# Altium project nanoga_mezzanine.PrjPCB (part 2 of 2)

## Sheet B2B_connectors .SchDoc: =ProjectName
size 420 x 297 mm; Author: SBH; CompanyName: WUT; DrawnBy: SBH; Organization: ISE-WUT; Address1: Warsaw Univeristy of Technology; Address2: Nowowiejska 15/19; Revision: -; SheetNumber: -; SheetTotal: -; EDA_Number: ARTIQ; Projet: ADC/DAC MEZZANINE; ModifiedBy: -; CreateDate: XX/XX/XXXX; CheckedDate: -; Title2: B2B_connectors .SchDoc; DivGrp: ISE; Designer: SBH; ModifiedDate: -; ProjectName: ADC/DAC MEZZANINE
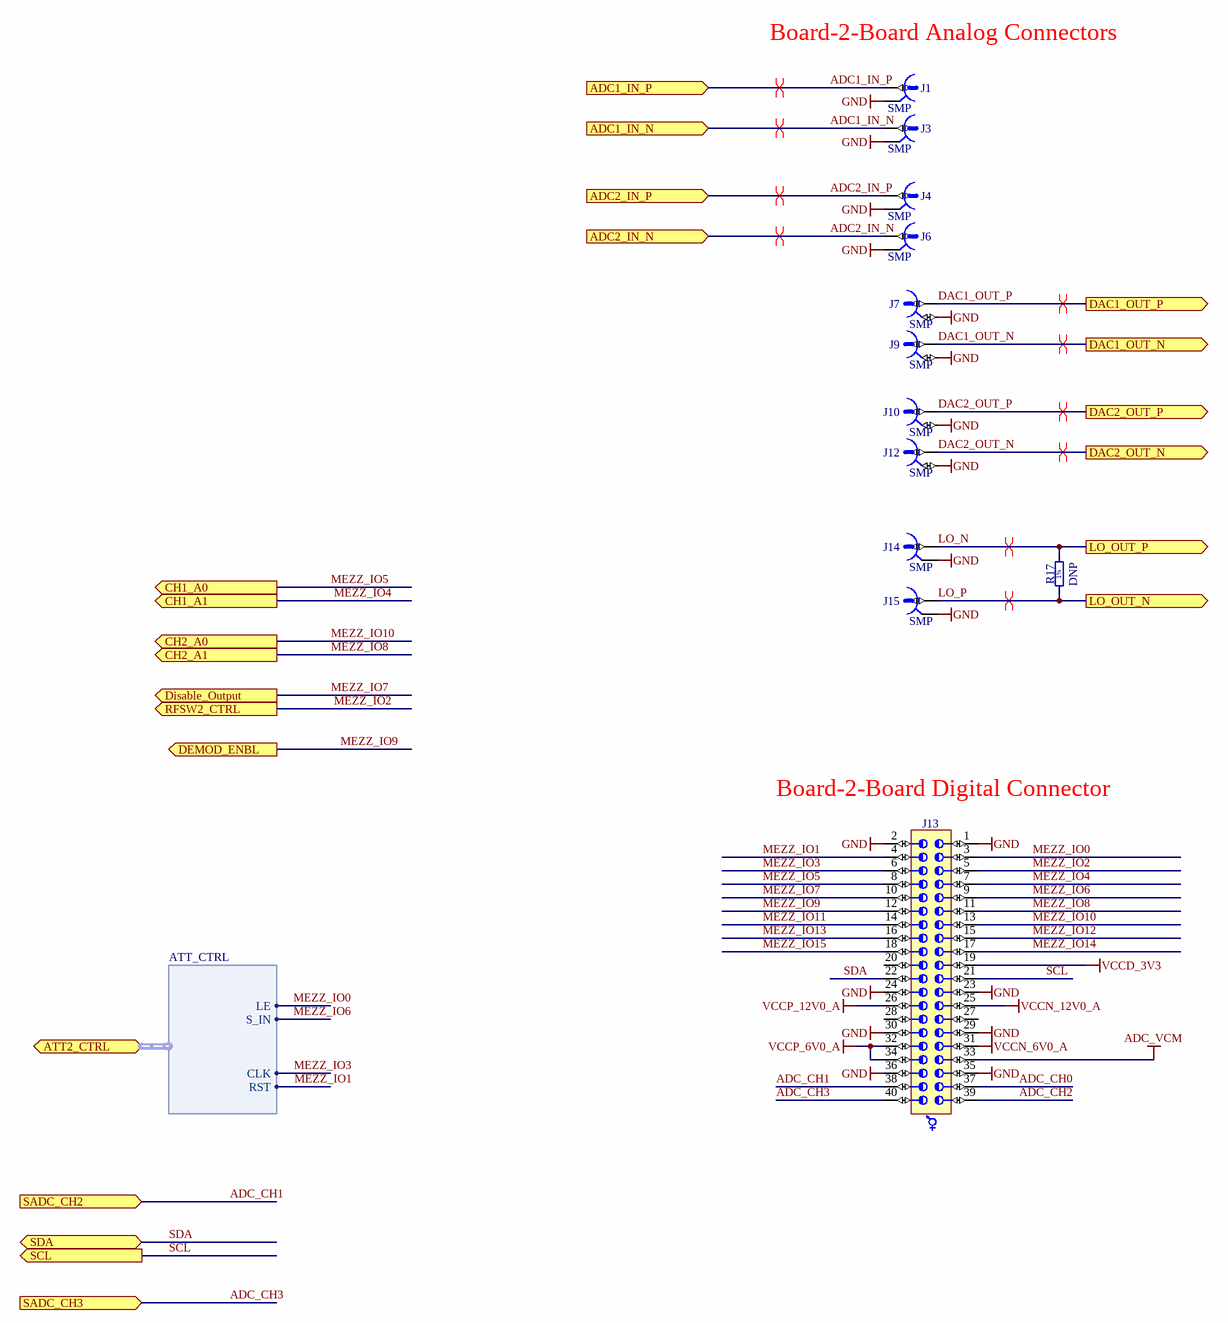
[diagram p3: B2B_connectors .SchDoc]

### Parts
J1  SMP  [AMPHENOL_SMP-MSLD-PCT-10]
J3  SMP  [AMPHENOL_SMP-MSLD-PCT-10]
J4  SMP  [AMPHENOL_SMP-MSLD-PCT-10]
J6  SMP  [AMPHENOL_SMP-MSLD-PCT-10]
J7  SMP  [MOLEX_85305-0232]
J9  SMP  [MOLEX_85305-0232]
J10  SMP  [MOLEX_85305-0232]
J12  SMP  [MOLEX_85305-0232]
J13  (no value)  [SAMTEC_LSS-120-02-L-DV-A]
J14  SMP  [AMPHENOL_SMP-MSLD-PCT-10]
J15  SMP  [AMPHENOL_SMP-MSLD-PCT-10]
R17  DNP  [RESC1005X40N]

### Ports
ADC1_IN_N (in), ADC1_IN_P (in), ADC2_IN_N (in), ADC2_IN_P (in), ATT2_CTRL (harness ATT_CTRL), CH1_A0 (out), CH1_A1 (out), CH2_A0 (out), CH2_A1 (out), DAC1_OUT_N (out), DAC1_OUT_P (out), DAC2_OUT_N (out), DAC2_OUT_P (out), DEMOD_ENBL (out), Disable_Output (out), LO_OUT_N (out), LO_OUT_P (out), RFSW2_CTRL (out), SADC_CH2 (in), SADC_CH3 (in), SCL (out), SDA (bidir)

### Harnesses
ATT_CTRL: LE, S_IN, CLK, RST

### Nets
ADC_VCM: J13.33
GND: J1.2 J3.2 J4.2 J6.2 J7.2 J9.2 J10.2 J12.2 J13.1 J13.2 J13.23 J13.24 J13.29 J13.30 J13.35 J13.36 J14.2 J15.2
VCCD_3V3: J13.19
VCCN_6V0_A: J13.31
VCCN_12V0_A: J13.25
VCCP_6V0_A: J13.32 J13.34
VCCP_12V0_A: J13.26
ADC1_IN_N: J3.1 ; port ADC1_IN_N
ADC1_IN_P: J1.1 ; port ADC1_IN_P
ADC2_IN_N: J6.1 ; port ADC2_IN_N
ADC2_IN_P: J4.1 ; port ADC2_IN_P
ADC_CH0: J13.37
ADC_CH1: J13.38 ; port SADC_CH2  [project net DAC2_PD]
ADC_CH2: J13.39
ADC_CH3: J13.40 ; port SADC_CH3
DAC1_OUT_N: J9.1 ; port DAC1_OUT_N
DAC1_OUT_P: J7.1 ; port DAC1_OUT_P
DAC2_OUT_N: J12.1 ; port DAC2_OUT_N
DAC2_OUT_P: J10.1 ; port DAC2_OUT_P
LO_N: J14.1 R17.2 ; port LO_OUT_P  [project net LOM_P]
LO_P: J15.1 R17.1 ; port LO_OUT_N  [project net LOM_N]
MEZZ_IO0: J13.3 ; port ATT2_CTRL.LE  [project net ATT2_CTRL.LE]
MEZZ_IO1: J13.4 ; port ATT2_CTRL.RST  [project net ATT2_CTRL.RST]
MEZZ_IO2: J13.5 ; port RFSW2_CTRL  [project net RFSW2_CTRL]
MEZZ_IO3: J13.6 ; port ATT2_CTRL.CLK  [project net ATT2_CTRL.CLK]
MEZZ_IO4: J13.7 ; port CH1_A1
MEZZ_IO5: J13.8 ; port CH1_A0
MEZZ_IO6: J13.9 ; port ATT2_CTRL.S_IN  [project net ATT2_CTRL.S_IN]
MEZZ_IO7: J13.10 ; port Disable_Output  [project net Disable_Output]
MEZZ_IO8: J13.11 ; port CH2_A1
MEZZ_IO9: J13.12 ; port DEMOD_ENBL
MEZZ_IO10: J13.13 ; port CH2_A0
MEZZ_IO11: J13.14
MEZZ_IO12: J13.15
MEZZ_IO13: J13.16
MEZZ_IO14: J13.17
MEZZ_IO15: J13.18
SCL: J13.21 ; port SCL
SDA: J13.22 ; port SDA

Not connected (* = marked no-connect by the designer): J13 20 27 28

### Layout directives
differential pair: ADC1_IN_N, ADC1_IN_P, ADC2_IN_N, ADC2_IN_P, DAC1_OUT_N, DAC1_OUT_P, DAC2_OUT_N, DAC2_OUT_P, LOM_N, LOM_P

### Notes on the sheet
- (near J1) Board-2-Board Analog Connectors
- (near J13) Board-2-Board Digital Connector
- Project/Equipment
- Document
- Designer
- Drawn by
- Check.by
- File
- Last Mod.
- Print Date
- Sheet
- Size
- A3
- of
- Rev
- (in symbol R0402_100R_1%_0.0625W_100PPM) 1%

### Library data of the parts
J1 J3 J4 J6 J14 J15 = CON_SMP-MSLD-PCT-10: 50 Ohms, SMP Surface/THT Mount Plug, Limited Detent; Part Description: 50 Ohms, SMP Surface Mount Plug, Limited Detent; Manufacturer: AMPHENOL; PressFit: No; Part Number: AMPHENOL_SMP-MSLD-PCT-10; Component Kind: Standard; Component Type: Standard; Pin Count: 2; Family: SMP; Mounted: Yes; Socket: No; SMD: No; Sense: No; Status: None; Manufacturer Part Number: SMP-MSLD-PCT-10; ComponentHeight: 4.1mm; HelpURL: \\cern.ch\dfs\Applications\Altium\Datasheets\MOLEX_85305-0232.pdf; Author: GK; CreateDate: 11.11.2016; LatestRevisionDate: 11.11.2016
J7 J9 J10 J12 = MOLEX_85305-0232: Part Description: 50 Ohms, SMP Surface Mount Plug, Limited Detent; Manufacturer: MOLEX; PressFit: No; Part Number: MOLEX_85305-0232; Component Kind: Standard; Component Type: Standard; Pin Count: 2; Family: SMP; Mounted: Yes; Socket: No; SMD: Yes; Sense: No; Status: None; Manufacturer Part Number: 85305-0232; ComponentHeight: 4.1mm; HelpURL: \\cern.ch\dfs\Applications\Altium\Datasheets\MOLEX_85305-0232.pdf; Author: CERN DEM JMW; CreateDate: 09.08.2016; LatestRevisionDate: 09.08.2016
J13 = CON_SAMTEC_LSS-120-02-L-DV-A: 40 Contacts, Pitch 0.635mm, Razor Beam LSS Vertical High Speed Hermaphroditic Strip (Lead Style 7.49mm); Part Description: 40 Contacts, Pitch 0.635mm, Razor Beam LSS Vertical High Speed Hermaphroditic Strip (Lead Style 5.49mm); Manufacturer: SAMTEC; PressFit: No; Part Number: SAMTEC_LSS-120-02-L-DV-A; Component Kind: Standard; Component Type: Standard; Pin Count: 40; Mounted: Yes; Socket: No; Sense: No; SMD: Yes; Status: None; Manufacturer Part Number: LSS-120-02-L-DV-A; ComponentHeight: 5.57mm; HelpURL: \\cern.ch\dfs\Applications\Altium\Datasheets\SAMTEC_LSS-120-03-L-DV-A.pdf; Author: CERN DEM JMW; CreateDate: 10.11.2015; LatestRevisionDate: 10.11.2015
R17 = R0402_100R_1%_0.0625W_100PPM: Resistor - 1%; Part Description: General Purpose Thick Film Chip Resistor; Manufacturer: GENERIC; Manufacturer1 Part Number: 232270671001L; Value: 100; TC: ±100ppm/°C; Mounted: DNP; Part Number: R0402_100R_1%_0.0625W_100PPM; Component Kind: Standard; Component Type: Standard; Pin Count: 2; Status: Not recommended; Power: 0.0625W; Tolerance: ±1%; Manufacturer Part Number: R0402_100R_1%_0.0625W_100PPM; Case: 0402; Sense: No; Socket: No; SMD: Yes; Manufacturer1 Example: YAGEO PHYCOMP; Manufacturer1 ComponentHeight: 0.4mm; HelpURL: \\cern.ch\dfs\Applications\Altium\Datasheets\R0402_Phycomp_RC0402.pdf; Author: CERN DEM JLC; CreateDate: 03.12.2007; LatestRevisionDate: 17.10.2012

## Sheet PowerSupply.SchDoc: =ProjectName
size 420 x 297 mm; Author: SBH; CompanyName: WUT; DrawnBy: SBH; Organization: ISE-WUT; Address1: Warsaw Univeristy of Technology; Address2: Nowowiejska 15/19; Revision: -; SheetNumber: -; SheetTotal: -; EDA_Number: ARTIQ; Projet: ADC/DAC MEZZANINE; ModifiedBy: -; CreateDate: XX/XX/XXXX; CheckedDate: -; Title2: PowerSupply.SchDoc; DivGrp: ISE; Designer: SBH; ModifiedDate: -; ProjectName: ADC/DAC MEZZANINE
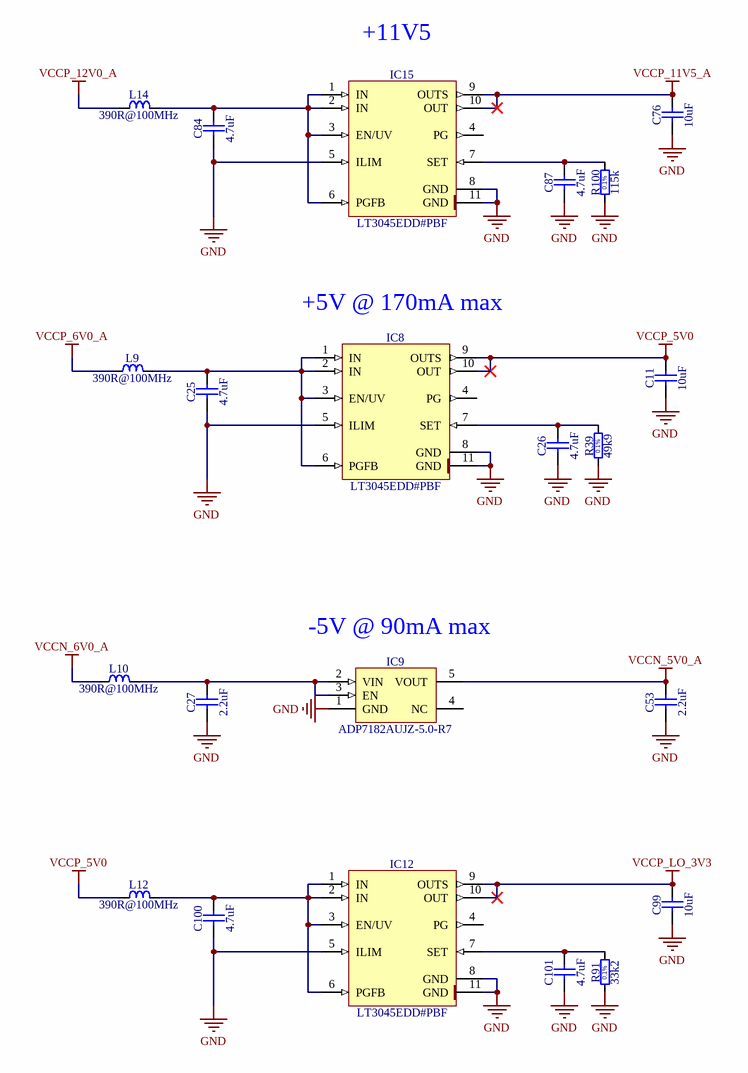
[diagram p4: PowerSupply.SchDoc]

### Parts
C11  10uF  [CAPC1608X87N]
C25  4.7uF  [CAPC1709X95N]
C26  4.7uF  [CAPC1709X95N]
C27  2.2uF  [CAPC1608X90N]
C53  2.2uF  [CAPC1608X90N]
C76  10uF  [CAPC1608X87N]
C84  4.7uF  [CAPC1709X95N]
C87  4.7uF  [CAPC1709X95N]
C99  10uF  [CAPC1608X87N]
C100  4.7uF  [CAPC1709X95N]
C101  4.7uF  [CAPC1709X95N]
IC8  LT3045EDD#PBF  [SON50P300X300X80-11N-R175X248]
IC9  ADP7182AUJZ-5.0-R7  [SOT95P280X90-5N]
IC12  LT3045EDD#PBF  [SON50P300X300X80-11N-R175X248]
IC15  LT3045EDD#PBF  [SON50P300X300X80-11N-R175X248]
L9  390R@100MHz  [INDC1608X95N]
L10  390R@100MHz  [INDC1608X95N]
L12  390R@100MHz  [INDC1608X95N]
L14  390R@100MHz  [INDC1608X95N]
R39  49k9  [RESC1608X55N]
R91  33k2  [RESC1608X55N]
R100  115k  [RESC1608X55N]

### Nets
GND: C11.1 C25.1 C26.1 C27.1 C53.1 C76.1 C84.1 C87.1 C99.1 C100.1 C101.1 IC8.5(ILIM) IC8.8(GND) IC8.11(GND) IC9.1(GND) IC12.5(ILIM) IC12.8(GND) IC12.11(GND) IC15.5(ILIM) IC15.8(GND) IC15.11(GND) R39.1 R91.1 R100.1
VCCN_5V0_A: C53.2 IC9.5(VOUT)
VCCN_6V0_A: L10.1
VCCP_5V0: C11.2 IC8.9(OUTS) IC8.10(OUT) L12.1
VCCP_6V0_A: L9.1
VCCP_11V5_A: C76.2 IC15.9(OUTS) IC15.10(OUT)
VCCP_12V0_A: L14.1
VCCP_LO_3V3: C99.2 IC12.9(OUTS) IC12.10(OUT)
NetC25_2: C25.2 IC8.1(IN) IC8.2(IN) IC8.3(EN/UV) IC8.6(PGFB) L9.2
NetC26_2: C26.2 IC8.7(SET) R39.2
NetC27_2: C27.2 IC9.2(VIN) IC9.3(EN) L10.2
NetC84_2: C84.2 IC15.1(IN) IC15.2(IN) IC15.3(EN/UV) IC15.6(PGFB) L14.2
NetC87_2: C87.2 IC15.7(SET) R100.2
NetC100_2: C100.2 IC12.1(IN) IC12.2(IN) IC12.3(EN/UV) IC12.6(PGFB) L12.2
NetC101_2: C101.2 IC12.7(SET) R91.2

Not connected (* = marked no-connect by the designer): IC8 4(PG); IC9 4(NC); IC12 4(PG); IC15 4(PG)

### Notes on the sheet
- (near IC15) +11V5
- (near IC8) +5V @ 170mA max
- (near IC9) -5V @ 90mA max
- Project/Equipment
- Document
- Designer
- Drawn by
- Check.by
- File
- Last Mod.
- Print Date
- Sheet
- Size
- A3
- of
- Rev
- (in symbol R0603_33K2_0.1%_0.063W_10PPM) 0.1%
- (in symbol R0603_49K9_0.1%_0.063W_10PPM) 0.1%
- (in symbol R0603_115K_0.1%_0.063W_10PPM) 0.1%

### Library data of the parts
C11 C76 C99 = CC0603_10UF_6.3V_20%_X5R: Non-polarised capacitor; Part Description: SMD Multilayer Chip Ceramic Capacitor; Manufacturer: GENERIC; Manufacturer1 Part Number: C0603C106M9PAC; Voltage: 6.3V; TC: X5R; Tolerance: ±20%; Part Number: CC0603_10UF_6.3V_20%_X5R; Component Kind: Standard; Component Type: Standard; Pin Count: 2; Value: 10uF; Status: Preferred; Manufacturer Part Number: CC0603_10uF_6.3V_20%_X5R; Case: 0603; Mounted: Yes; Socket: No; SMD: Yes; Sense: No; Manufacturer1 Example: KEMET; Manufacturer1 ComponentHeight: 0.95mm; HelpURL: \\cern.ch\dfs\Applications\Altium\Datasheets\CC0603_X5R_KEMET.pdf; Author: CERN DEM JLC; CreateDate: 2007-12-03; LatestRevisionDate: 2007-12-03
C25 C26 C84 C87 C100 C101 = CC0603_4.7UF_16V_10%_X5R: Non-polarised capacitor; Part Description: SMD Multilayer Chip Ceramic Capacitor; Manufacturer: GENERIC; Manufacturer1 Part Number: EMK107ABJ475KA-T; Voltage: 16V; TC: X5R; Tolerance: ±10%; Part Number: CC0603_4.7UF_16V_10%_X5R; Component Kind: Standard; Component Type: Standard; Pin Count: 2; Value: 4.7uF; Status: None; Manufacturer Part Number: CC0603_4.7UF_16V_10%_X5R; Case: 0603; Mounted: Yes; Socket: No; SMD: Yes; Sense: No; Manufacturer1 Example: TAIYO YUDEN; Manufacturer1 ComponentHeight: 0.95mm; HelpURL: \\cern.ch\dfs\Applications\Altium\Datasheets\CC0603_X7R_TAIYO-YUDEN_HIGH-VALUE.pdf; Author: CERN DEM JLC; CreateDate: 2013-12-16; LatestRevisionDate: 2014-09-16
C27 C53 = CC0603_2.2UF_10V_20%_X7R: Non-polarised capacitor; Part Description: SMD Multilayer Chip Ceramic Capacitor; Manufacturer: GENERIC; Manufacturer1 Part Number: LMK107B7225MA-T; Voltage: 10V; TC: X7R; Tolerance: ±20%; Part Number: CC0603_2.2UF_10V_20%_X7R; Component Kind: Standard; Component Type: Standard; Pin Count: 2; Value: 2.2uF; Status: Not Recommended; Manufacturer Part Number: CC0603_2.2UF_10V_20%_X7R; Case: 0603; Mounted: Yes; Socket: No; SMD: Yes; Sense: No; Manufacturer1 Example: TAIYO YUDEN; Manufacturer1 ComponentHeight: 0.9mm; HelpURL: \\cern.ch\dfs\Applications\Altium\Datasheets\CC0603_X7R_TAIYO-YUDEN_HIGH-VALUE.pdf; Author: CERN DEM JLC; CreateDate: 2011-06-22; LatestRevisionDate: 2011-06-27
IC8 IC12 IC15 = LT3045EDD#PBF: 20V, 500mA, Ultralow Noise, Ultrahigh PSRR Linear Regulator; Manufacturer: LINEAR TECHNOLOGY; PressFit: No; Bonding: No; Part Number: LT3045EDD#PBF; Component Kind: Standard; Component Type: Standard; Device: LT3045EDD#PBF; PackageDescription: SON, 0.50mm Pitch, 10-pin, 3.00mm W  X 3.00mm L X 0.80mm Height, (w/thermal tab 1.75 X 2.48 mm), IPC Medium Density; Part Description: 20V, 500mA, Ultralow Noise, Ultrahigh PSRR Linear Regulator; Manufacturer Part Number: LT3045EDD#PBF; Pin Count: 11; Case: SON10; Mounted: Yes; Socket: No; SMD: Yes; Sense: No; ComponentHeight: 0.8mm; HelpURL: \\cern.ch\dfs\Applications\Altium\Datasheets\LT3045EDD#PBF.pdf; Author: CERN DEM JLC; CreateDate: 2016-12-07; LatestRevisionDate: 2016-12-07
IC9 = ADP7182AUJZ-5.0-R7: –5V, 200 mA, Low Noise, Linear Regulator; Part Description: –5V, -200mA, Low Noise, Linear Regulator; Manufacturer: ANALOG DEVICES; PressFit: No; Bonding: No; Part Number: ADP7182AUJZ-5.0-R7; Component Kind: Standard; Component Type: Standard; Device: ADP7182AUJZ-5.0-R7; PackageDescription: SOT23, 0.95mm pitch; 5 pin, 1.75mm W X 3.00mm L, IPC Medium Density; Manufacturer Part Number: ADP7182AUJZ-5.0-R7; Pin Count: 5; Case: SOT23-5; Mounted: Yes; Socket: No; SMD: Yes; Sense: No; ComponentHeight: 0.9mm; HelpURL: \\cern.ch\dfs\Applications\Altium\Datasheets\ADP7182AUJZ-5.0-R7.pdf; Author: CERN DEM JLC; CreateDate: 17.03.2014; LatestRevisionDate: 17.03.2014
L9 L10 L12 L14 = IND0603_TDK_MPZ1608R391A: Inductor; Part Description: SMT Chip Bead for Power Line; Manufacturer: TDK; Power: 1.2A; Resistance: 0.12R; Tolerance: ±25%; Part Number: IND0603_TDK_MPZ1608R391A; Component Kind: Standard; Component Type: Standard; Pin Count: 2; Value: 390R@100MHz; Status: None; Manufacturer Part Number: MPZ1608R391A; Case: 0603; Mounted: Yes; Socket: No; SMD: Yes; Sense: No; ComponentHeight: 0.95mm; HelpURL: \\cern.ch\dfs\Applications\Altium\Datasheets\IND0603_TDK_MPZ1608.pdf; Author: CERN DEM JLC; CreateDate: 2009-12-02; LatestRevisionDate: 2009-12-02
R39 = R0603_49K9_0.1%_0.063W_10PPM: Resistor - 0.1%; Part Description: Thin Film Chip Resistor; Manufacturer: GENERIC; Manufacturer1 Part Number: RN73C1J49K9BTDF; Power: 0.063W; TC: ±10ppm; Part Number: R0603_49K9_0.1%_0.063W_10PPM; Component Kind: Standard; Component Type: Standard; Pin Count: 2; Value: 49k9; Status: Not recommended; Tolerance: ±0.1%; Manufacturer Part Number: R0603_49K9_0.1%_0.063W_10PPM; Case: 0603; Mounted: Yes; Sense: No; Socket: No; SMD: Yes; Manufacturer1 Example: TYCO HOLSWORTHY; Manufacturer1 ComponentHeight: 0.5mm; HelpURL: \\cern.ch\dfs\Applications\Altium\Datasheets\R0603_Tyco_RN73.pdf; Author: CERN DEM JLC; CreateDate: 2007-12-03; LatestRevisionDate: 2008-03-13
R91 = R0603_33K2_0.1%_0.063W_10PPM: Resistor - 0.1%; Part Description: Thin Film Chip Resistor; Manufacturer: GENERIC; Manufacturer1 Part Number: RN73C1J33K2BTDF; Power: 0.063W; TC: ±10ppm; Part Number: R0603_33K2_0.1%_0.063W_10PPM; Component Kind: Standard; Component Type: Standard; Pin Count: 2; Value: 33k2; Status: Not recommended; Tolerance: ±0.1%; Manufacturer Part Number: R0603_33K2_0.1%_0.063W_10PPM; Case: 0603; Mounted: Yes; Sense: No; Socket: No; SMD: Yes; Manufacturer1 Example: TYCO HOLSWORTHY; Manufacturer1 ComponentHeight: 0.5mm; HelpURL: \\cern.ch\dfs\Applications\Altium\Datasheets\R0603_Tyco_RN73.pdf; Author: CERN DEM JLC; CreateDate: 2007-12-03; LatestRevisionDate: 2008-03-13
R100 = R0603_115K_0.1%_0.063W_10PPM: Resistor - 0.1%; Part Description: Thin Film Chip Resistor; Manufacturer: GENERIC; Manufacturer1 Part Number: RN73C1J115KBTDF; Power: 0.063W; TC: ±10ppm; Part Number: R0603_115K_0.1%_0.063W_10PPM; Component Kind: Standard; Component Type: Standard; Pin Count: 2; Value: 115k; Status: Not recommended; Tolerance: ±0.1%; Manufacturer Part Number: R0603_115K_0.1%_0.063W_10PPM; Case: 0603; Mounted: Yes; Sense: No; Socket: No; SMD: Yes; Manufacturer1 Example: TYCO HOLSWORTHY; Manufacturer1 ComponentHeight: 0.5mm; HelpURL: \\cern.ch\dfs\Applications\Altium\Datasheets\R0603_Tyco_RN73.pdf; Author: CERN DEM JLC; CreateDate: 2007-12-03; LatestRevisionDate: 2008-03-13

## Sheet IQ_Modulator.SchDoc: =ProjectName
size 420 x 297 mm; Author: SBH; CompanyName: WUT; DrawnBy: SBH; Organization: ISE-WUT; Address1: Warsaw Univeristy of Technology; Address2: Nowowiejska 15/19; Revision: -; SheetNumber: -; SheetTotal: -; EDA_Number: ARTIQ; Projet: ADC/DAC MEZZANINE; ModifiedBy: -; CreateDate: XX/XX/XXXX; CheckedDate: -; Title2: IQ_Modulator.SchDoc; DivGrp: ISE; Designer: SBH; ModifiedDate: -; ProjectName: ADC/DAC MEZZANINE
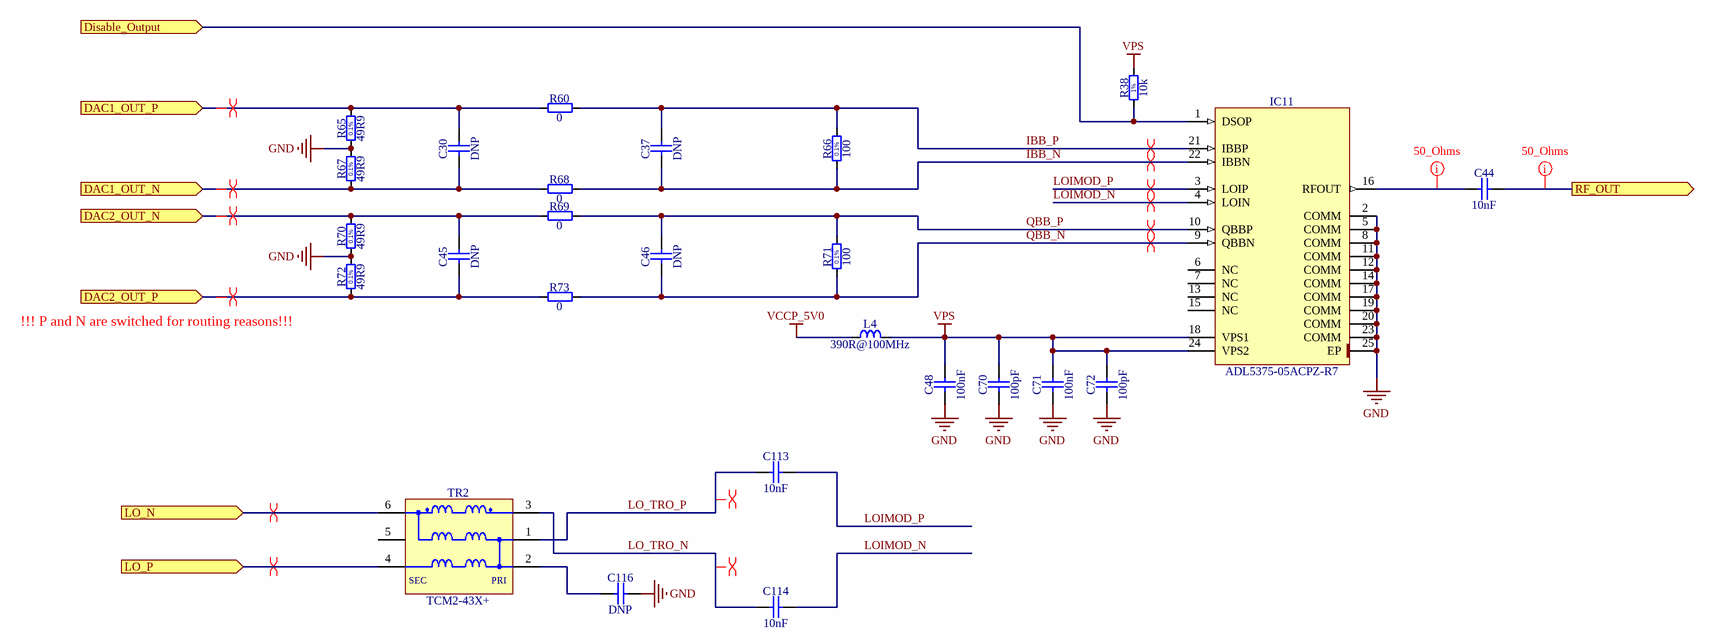
[diagram p5: IQ_Modulator.SchDoc]

### Parts
C30  DNP  [CAPC1005X55N]
C37  DNP  [CAPC1005X55N]
C44  10nF  [CAPC1005X55N]
C45  DNP  [CAPC1005X55N]
C46  DNP  [CAPC1005X55N]
C48  100nF  [CAPC1005X55N]
C70  100pF  [CAPC1005X55N]
C71  100nF  [CAPC1005X55N]
C72  100pF  [CAPC1005X55N]
C113  10nF  [CAPC1005X55N]
C114  10nF  [CAPC1005X55N]
C116  DNP  [CAPC1005X55N]
IC11  ADL5375-05ACPZ-R7  [QFN50P400X400X100-25N-S265]
L4  390R@100MHz  [INDC1608X95N]
R38  10k  [RESC1005X40N]
R60  0  [RESC1005X40N]
R65  49R9  [RESC1005X35N]
R66  100  [RESC1005X35N]
R67  49R9  [RESC1005X35N]
R68  0  [RESC1005X40N]
R69  0  [RESC1005X40N]
R70  49R9  [RESC1005X35N]
R71  100  [RESC1005X35N]
R72  49R9  [RESC1005X35N]
R73  0  [RESC1005X40N]
TR2  TCM2-43X+  [XFMR_MINI-CIRCUITS_DB1627]

### Ports
DAC1_OUT_N (in), DAC1_OUT_P (in), DAC2_OUT_N (in), DAC2_OUT_P (in), Disable_Output (in), LO_N (in), LO_P (in), RF_OUT (out)

### Nets
GND: C48.1 C70.1 C71.1 C72.1 C116.2 IC11.2(COMM) IC11.5(COMM) IC11.8(COMM) IC11.11(COMM) IC11.12(COMM) IC11.14(COMM) IC11.17(COMM) IC11.19(COMM) IC11.20(COMM) IC11.23(COMM) IC11.25(EP) R65.1 R67.2 R70.1 R72.2
VCCP_5V0: L4.1
VPS: C48.2 C70.2 C71.2 C72.2 IC11.18(VPS1) IC11.24(VPS2) L4.2 R38.2
DAC1_OUT_N: C30.1 R67.1 R68.1 ; port DAC1_OUT_N
DAC1_OUT_P: C30.2 R60.1 R65.2 ; port DAC1_OUT_P
DAC2_OUT_N: C45.2 R69.1 R70.2 ; port DAC2_OUT_N
DAC2_OUT_P: C45.1 R72.1 R73.1 ; port DAC2_OUT_P
Disable_Output: IC11.1(DSOP) R38.1 ; port Disable_Output
IBB_N: C37.1 IC11.22(IBBN) R66.1 R68.2
IBB_P: C37.2 IC11.21(IBBP) R60.2 R66.2
LO0_N: TR2.6(S1) ; port LO_N
LO0_P: TR2.4(S1) ; port LO_P
LO_TRO_N: C114.1 TR2.3(P1)
LO_TRO_P: C113.1 TR2.1(P1)
LOIMOD_N: C114.2 IC11.4(LOIN)
LOIMOD_P: C113.2 IC11.3(LOIP)
QBB_N: C46.1 IC11.9(QBBN) R71.1 R73.2
QBB_P: C46.2 IC11.10(QBBP) R69.2 R71.2
RF_IN: C44.2 ; port RF_OUT
NetC44_1: C44.1 IC11.16(RFOUT)
NetC116_1: C116.1 TR2.2(P1)

Not connected (* = marked no-connect by the designer): IC11 6(NC) 7(NC) 13(NC) 15(NC); TR2 5(NC)

### Layout directives
net class 50_Ohms: NetC44_1, RF_IN
differential pair: DAC1_OUT_N, DAC1_OUT_P, DAC2_OUT_N, DAC2_OUT_P, IBB_N, IBB_P, LO0_N, LO0_P, LO_TRO_N, LO_TRO_P, LOIMOD_N, LOIMOD_P, QBB_N, QBB_P

### Notes on the sheet
- (near R72) !!! P and N are switched for routing reasons!!!
- Project/Equipment
- Document
- Designer
- Drawn by
- Check.by
- File
- Last Mod.
- Print Date
- Sheet
- Size
- A3
- of
- Rev
- (in symbol R0402_10K_1%_0.0625W_100PPM) 1%
- (in symbol R0402_49R9_0.1%_0.063W_25PPM) 0.1%
- (in symbol R0402_100R_0.1%_0.063W_25PPM) 0.1%
- (in symbol XFMR_MINI-CIRCUITS_TCM2-43X+) SEC; PRI

### Library data of the parts
C30 C37 C45 C46 = CC0402_1.5NF_50V_10%_X7R: Non-polarised capacitor; Part Description: SMD Multilayer Chip Ceramic Capacitor; Manufacturer: GENERIC; Manufacturer1 Part Number: 223858715625; Value: 1.5nF; Voltage: 50V; TC: X7R; Tolerance: ±10%; Mounted: DNP; Part Number: CC0402_1.5NF_50V_10%_X7R; Component Kind: Standard; Component Type: Standard; Pin Count: 2; Status: Not Recommended; Manufacturer Part Number: CC0402_1.5NF_50V_10%_X7R; Case: 0402; Socket: No; SMD: Yes; Sense: No; Manufacturer1 Example: PHYCOMP; Manufacturer1 ComponentHeight: 0.55mm; HelpURL: \\cern.ch\dfs\Applications\Altium\Datasheets\CC0402_X7R_PHYCOMP.pdf; Author: CERN DEM JLC; CreateDate: 2007-12-03; LatestRevisionDate: 2007-12-03
C44 C113 C114 = CC0402_10NF_16V_10%_X7R: Non-polarised capacitor; Part Description: SMD Multilayer Chip Ceramic Capacitor; Manufacturer: GENERIC; Manufacturer1 Part Number: 223878715636; Voltage: 16V; TC: X7R; Tolerance: ±10%; Part Number: CC0402_10NF_16V_10%_X7R; Component Kind: Standard; Component Type: Standard; Pin Count: 2; Value: 10nF; Status: Not Recommended; Manufacturer Part Number: CC0402_10NF_16V_10%_X7R; Case: 0402; Mounted: Yes; Socket: No; SMD: Yes; Sense: No; Manufacturer1 Example: PHYCOMP; Manufacturer1 ComponentHeight: 0.55mm; HelpURL: \\cern.ch\dfs\Applications\Altium\Datasheets\CC0402_X7R_PHYCOMP.pdf; Author: CERN DEM JLC; CreateDate: 2007-12-03; LatestRevisionDate: 2007-12-03
C48 C71 = CC0402_100NF_16V_10%_X7R: Non-polarised capacitor; Part Description: SMD Multilayer Chip Ceramic Capacitor; Manufacturer: GENERIC; Manufacturer1 Part Number: GRM155R71C104KA88D; Voltage: 16V; TC: X7R; Tolerance: ±10%; Part Number: CC0402_100NF_16V_10%_X7R; Component Kind: Standard; Component Type: Standard; Pin Count: 2; Value: 100nF; Status: Not Recommended; Manufacturer Part Number: CC0402_100NF_16V_10%_X7R; Case: 0402; Mounted: Yes; Socket: No; SMD: Yes; Sense: No; Manufacturer1 Example: MURATA; Manufacturer1 ComponentHeight: 0.55mm; HelpURL: \\cern.ch\dfs\Applications\Altium\Datasheets\CC0402_X7R_MURATA_GRM.pdf; Author: CERN DEM JLC; CreateDate: 2013-12-05; LatestRevisionDate: 2007-12-03
C70 C72 = CC0402_100PF_50V_5%_C0G: Non-polarised capacitor; Part Description: SMD Multilayer Chip Ceramic Capacitor; Manufacturer: GENERIC; Manufacturer1 Part Number: C0402C101J5GACTU; Voltage: 50V; TC: C0G/NP0; Tolerance: ±5%; Part Number: CC0402_100PF_50V_5%_C0G; Component Kind: Standard; Component Type: Standard; Pin Count: 2; Value: 100pF; Status: Preferred; Manufacturer Part Number: CC0402_100PF_50V_5%_C0G; Case: 0402; Mounted: Yes; Socket: No; SMD: Yes; Sense: No; Manufacturer1 Example: KEMET; Manufacturer1 ComponentHeight: 0.55mm; HelpURL: \\cern.ch\dfs\Applications\Altium\Datasheets\CC0805_C0G_KEMET_(Commercial Grade).pdf; Author: CERN DEM JLC; CreateDate: 2007-12-03; LatestRevisionDate: 2015-04-22
C116 = CC0402_100PF_50V_5%_C0G: Non-polarised capacitor; Part Description: SMD Multilayer Chip Ceramic Capacitor; Manufacturer: GENERIC; Manufacturer1 Part Number: C0402C101J5GACTU; Value: 100pF; Voltage: 50V; TC: C0G/NP0; Tolerance: ±5%; Mounted: DNP; Part Number: CC0402_100PF_50V_5%_C0G; Component Kind: Standard; Component Type: Standard; Pin Count: 2; Status: Preferred; Manufacturer Part Number: CC0402_100PF_50V_5%_C0G; Case: 0402; Socket: No; SMD: Yes; Sense: No; Manufacturer1 Example: KEMET; Manufacturer1 ComponentHeight: 0.55mm; HelpURL: \\cern.ch\dfs\Applications\Altium\Datasheets\CC0805_C0G_KEMET_(Commercial Grade).pdf; Author: CERN DEM JLC; CreateDate: 2007-12-03; LatestRevisionDate: 2015-04-22
IC11 = ADL5375-05ACPZ-R7: 400 MHz to 6 GHz Broadband Quadrature Modulator; Manufacturer: ANALOG DEVICES; PressFit: No; Bonding: No; Part Number: ADL5375-05ACPZ-R7; Component Kind: Standard; Component Type: Standard; Device: ADL5375-05ACPZ-R7; PackageDescription: QFN,0.50mm pitch,square;6 pin X 6 pin,4.0mm X 4.0mm X 1.00mm H body (w/thermal tab 2.65 X 2.65mm),  IPC Medium Density; Part Description: 400 MHz to 6 GHz Broadband Quadrature Modulator; Manufacturer Part Number: ADL5375-05ACPZ-R7; Pin Count: 25; Case: QFN24; Mounted: Yes; Socket: No; SMD: Yes; Sense: No; ComponentHeight: 1mm; Author: CERN DEM JLC; HelpURL: \\cern.ch\dfs\Applications\Altium\Datasheets\ADL5375-05ACPZ-R7.pdf; CreateDate: 2010-08-24; LatestRevisionDate: 2010-08-24
L4 = IND0603_TDK_MPZ1608R391A: as L9 on sheet PowerSupply; Part Number: IND0603_TDK_MPZ1608R391A; Component Kind: Standard; Component Type: Standard; Pin Count: 2; Value: 390R@100MHz; Status: None; Manufacturer Part Number: MPZ1608R391A; Case: 0603; Mounted: Yes; Socket: No; SMD: Yes; Sense: No; ComponentHeight: 0.95mm; HelpURL: \\cern.ch\dfs\Applications\Altium\Datasheets\IND0603_TDK_MPZ1608.pdf; Author: CERN DEM JLC; CreateDate: 2009-12-02; LatestRevisionDate: 2009-12-02
R38 = R0402_10K_1%_0.0625W_100PPM: Resistor - 1%; Part Description: General Purpose Thick Film Chip Resistor; Manufacturer: GENERIC; Manufacturer1 Part Number: 232270671003L; TC: ±100ppm/°C; Part Number: R0402_10K_1%_0.0625W_100PPM; Component Kind: Standard; Component Type: Standard; Pin Count: 2; Value: 10k; Status: Not recommended; Power: 0.0625W; Tolerance: ±1%; Manufacturer Part Number: R0402_10K_1%_0.0625W_100PPM; Case: 0402; Mounted: Yes; Sense: No; Socket: No; SMD: Yes; Manufacturer1 Example: YAGEO PHYCOMP; Manufacturer1 ComponentHeight: 0.4mm; HelpURL: \\cern.ch\dfs\Applications\Altium\Datasheets\R0402_Phycomp_RC0402.pdf; Author: CERN DEM JLC; CreateDate: 2007-12-03; LatestRevisionDate: 2012-10-17
R60 R68 R69 R73 = R0402_0R_JUMPER: as R6 on sheet ADC_channel; Part Number: R0402_0R_JUMPER; Component Kind: Standard; Component Type: Standard; Pin Count: 2; Value: 0; Status: Not recommended; Manufacturer Part Number: R0402_0R_JUMPER; Case: 0402; Mounted: Yes; Sense: No; Socket: No; SMD: Yes; Manufacturer1 Example: YAGEO PHYCOMP; Manufacturer1 ComponentHeight: 0.4mm; HelpURL: \\cern.ch\dfs\Applications\Altium\Datasheets\R0402_Phycomp_RC0402.pdf; Author: CERN DEM JLC; CreateDate: 2007-12-03; LatestRevisionDate: 2012-10-17
R65 R67 R70 R72 = R0402_49R9_0.1%_0.063W_25PPM: Resistor - 0.1%; Part Description: Thin Film Precision Resistor; Manufacturer: GENERIC; Manufacturer1 Part Number: CPF0402B49R9E1; Power: 0.063W; TC: ±25ppm/°C; Part Number: R0402_49R9_0.1%_0.063W_25PPM; Component Kind: Standard; Component Type: Standard; Pin Count: 2; Value: 49R9; Status: Not Recommended; Tolerance: ±0.1%; Manufacturer Part Number: R0402_49R9_0.1%_0.063W_25PPM; Case: 0402; Mounted: Yes; Sense: No; Socket: No; SMD: Yes; Manufacturer1 Example: TE CONNECTIVITY; Manufacturer1 ComponentHeight: 0.35mm; HelpURL: \\cern.ch\dfs\Applications\Altium\Datasheets\R0402_TYCO_CPF.pdf; Author: CERN DEM JMW; CreateDate: 2015-09-22; LatestRevisionDate: 2015-09-22
R66 R71 = R0402_100R_0.1%_0.063W_25PPM: Resistor - 0.1%; Part Description: Thin Film Precision Resistor; Manufacturer: GENERIC; Manufacturer1 Part Number: CPF0402B100RE1; Power: 0.063W; TC: ±25ppm/°C; Part Number: R0402_100R_0.1%_0.063W_25PPM; Component Kind: Standard; Component Type: Standard; Pin Count: 2; Value: 100; Status: Not Recommended; Tolerance: ±0.1%; Manufacturer Part Number: R0402_100R_0.1%_0.063W_25PPM; Case: 0402; Mounted: Yes; Sense: No; Socket: No; SMD: Yes; Manufacturer1 Example: TE CONNECTIVITY; Manufacturer1 ComponentHeight: 0.35mm; HelpURL: \\cern.ch\dfs\Applications\Altium\Datasheets\R0402_TYCO_CPF.pdf; Author: CERN DEM JMW; CreateDate: 2015-09-22; LatestRevisionDate: 2015-09-22
TR2 = XFMR_MINI-CIRCUITS_TCM2-43X+: 50 OHMS 10 to 4000 MHz RF Transformer; Power: 0.4W; Part Number: XFMR_MINI-CIRCUITS_TCM2-43X+; Component Kind: Standard; Component Type: Standard; Pin Count: 6; Value: TCM2-43X+; Status: None; Part Description: 50 Ohms 10 to 4000MHz RF Transformer; Manufacturer: MINI-CIRCUITS; Manufacturer Part Number: TCM2-43X+; Mounted: Yes; Socket: No; Sense: No; SMD: Yes; ComponentHeight: 4.06mm; HelpURL: \\cern.ch\dfs\Applications\Altium\Datasheets\XFMR_MINI-CIRCUITS_TCM2-43X+.pdf; Author: CERN DEM BC; CreateDate: 2016-02-12; LatestRevisionDate: 2016-02-12

## Sheet LO_Distribution.SchDoc: =ProjectName
size 420 x 297 mm; Author: SBH; CompanyName: WUT; DrawnBy: SBH; Organization: ISE-WUT; Address1: Warsaw Univeristy of Technology; Address2: Nowowiejska 15/19; Revision: -; SheetNumber: -; SheetTotal: -; EDA_Number: ARTIQ; Projet: ADC/DAC MEZZANINE; ModifiedBy: -; CreateDate: XX/XX/XXXX; CheckedDate: -; Title2: LO_Distribution.SchDoc; DivGrp: ISE; Designer: SBH; ModifiedDate: -; ProjectName: ADC/DAC MEZZANINE
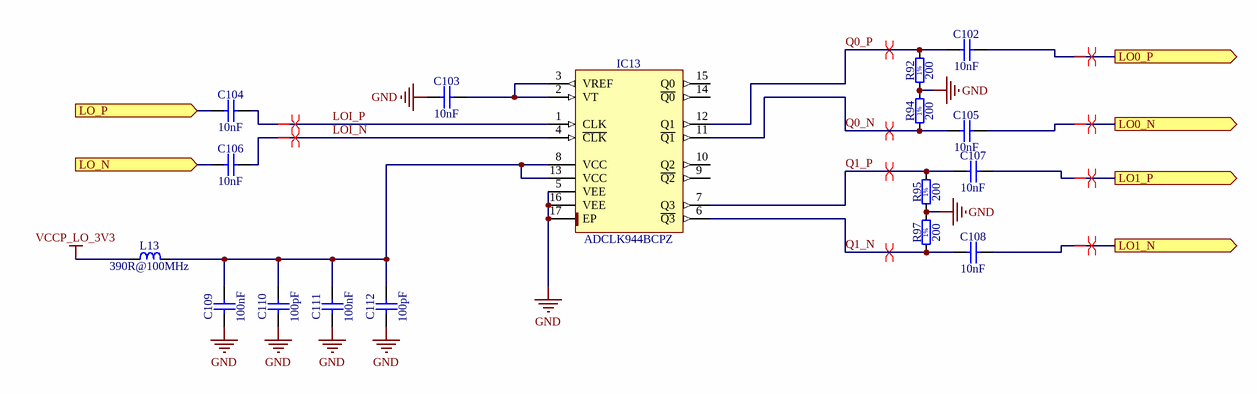
[diagram p6: LO_Distribution.SchDoc]

### Parts
C102  10nF  [CAPC1005X55N]
C103  10nF  [CAPC1005X55N]
C104  10nF  [CAPC1005X55N]
C105  10nF  [CAPC1005X55N]
C106  10nF  [CAPC1005X55N]
C107  10nF  [CAPC1005X55N]
C108  10nF  [CAPC1005X55N]
C109  100nF  [CAPC1005X55N]
C110  100pF  [CAPC1005X55N]
C111  100nF  [CAPC1005X55N]
C112  100pF  [CAPC1005X55N]
IC13  ADCLK944BCPZ  [QFN50P300X300X80-17N-S160]
L13  390R@100MHz  [INDC1608X95N]
R92  200  [RESC1005X40N]
R94  200  [RESC1005X40N]
R95  200  [RESC1005X40N]
R97  200  [RESC1005X40N]

### Ports
LO0_N (out), LO0_P (out), LO1_N (out), LO1_P (out), LO_N (in), LO_P (in)

### Nets
GND: C103.1 C109.1 C110.1 C111.1 C112.1 IC13.5(VEE) IC13.16(VEE) IC13.17(EP) R92.1 R94.2 R95.1 R97.2
VCCP_LO_3V3: L13.1
LO0_N: C105.2 ; port LO0_N
LO0_P: C102.2 ; port LO0_P
LO1_N: C108.2 ; port LO1_N
LO1_P: C107.2 ; port LO1_P
LOI_N: C106.2 IC13.4(~{CLK})
LOI_P: C104.2 IC13.1(CLK)
LOM_N: C106.1 ; port LO_N
LOM_P: C104.1 ; port LO_P
Q0_N: C105.1 IC13.11(~{Q1}) R94.1
Q0_P: C102.1 IC13.12(Q1) R92.2
Q1_N: C108.1 IC13.6(~{Q3}) R97.1
Q1_P: C107.1 IC13.7(Q3) R95.2
NetC103_2: C103.2 IC13.2(VT) IC13.3(VREF)
NetC109_2: C109.2 C110.2 C111.2 C112.2 IC13.8(VCC) IC13.13(VCC) L13.2

Not connected (* = marked no-connect by the designer): IC13 9(~{Q2}) 10(Q2) 14(~{Q0}) 15(Q0)

### Layout directives
differential pair: LO0_N, LO0_P, LO1_N, LO1_P, LOI_N, LOI_P, Q0_N, Q0_P, Q1_N, Q1_P

### Notes on the sheet
- Project/Equipment
- Document
- Designer
- Drawn by
- Check.by
- File
- Last Mod.
- Print Date
- Sheet
- Size
- A3
- of
- Rev
- (in symbol R0402_200R_1%_0.0625W_100PPM) 1%

### Library data of the parts
C102-C108 = CC0402_10NF_16V_10%_X7R: as C44 on sheet IQ_Modulator; Part Number: CC0402_10NF_16V_10%_X7R; Component Kind: Standard; Component Type: Standard; Pin Count: 2; Value: 10nF; Status: Not Recommended; Manufacturer Part Number: CC0402_10NF_16V_10%_X7R; Case: 0402; Mounted: Yes; Socket: No; SMD: Yes; Sense: No; Manufacturer1 Example: PHYCOMP; Manufacturer1 ComponentHeight: 0.55mm; HelpURL: \\cern.ch\dfs\Applications\Altium\Datasheets\CC0402_X7R_PHYCOMP.pdf; Author: CERN DEM JLC; CreateDate: 2007-12-03; LatestRevisionDate: 2007-12-03
C109 C111 = CC0402_100NF_16V_10%_X7R: as C48 on sheet IQ_Modulator; Part Number: CC0402_100NF_16V_10%_X7R; Component Kind: Standard; Component Type: Standard; Pin Count: 2; Value: 100nF; Status: Not Recommended; Manufacturer Part Number: CC0402_100NF_16V_10%_X7R; Case: 0402; Mounted: Yes; Socket: No; SMD: Yes; Sense: No; Manufacturer1 Example: MURATA; Manufacturer1 ComponentHeight: 0.55mm; HelpURL: \\cern.ch\dfs\Applications\Altium\Datasheets\CC0402_X7R_MURATA_GRM.pdf; Author: CERN DEM JLC; CreateDate: 2013-12-05; LatestRevisionDate: 2007-12-03
C110 C112 = CC0402_100PF_50V_5%_C0G: as C70 on sheet IQ_Modulator; Part Number: CC0402_100PF_50V_5%_C0G; Component Kind: Standard; Component Type: Standard; Pin Count: 2; Value: 100pF; Status: Preferred; Manufacturer Part Number: CC0402_100PF_50V_5%_C0G; Case: 0402; Mounted: Yes; Socket: No; SMD: Yes; Sense: No; Manufacturer1 Example: KEMET; Manufacturer1 ComponentHeight: 0.55mm; HelpURL: \\cern.ch\dfs\Applications\Altium\Datasheets\CC0805_C0G_KEMET_(Commercial Grade).pdf; Author: CERN DEM JLC; CreateDate: 2007-12-03; LatestRevisionDate: 2015-04-22
IC13 = ADCLK944BCPZ: 2.5V/3.3V, Four LVPECL Outputs, SiGe Clock Fanout Buffer; Manufacturer: ANALOG DEVICES; PressFit: No; Bonding: No; Part Number: ADCLK944BCPZ; Component Kind: Standard; Component Type: Standard; Device: ADCLK944BCPZ; PackageDescription: QFN, 0.50mm Pitch, Square; 4 Pin X 4 Pin, 3mm X 3mm X 0.80mm H Body (w/Thermal tab 1.60 X 1.60mm),  IPC Medium Density; Part Description: 2.5V/3.3V, Four LVPECL Outputs, SiGe Clock Fanout Buffer; Manufacturer Part Number: ADCLK944BCPZ; Pin Count: 17; Case: QFN16; Mounted: Yes; Socket: No; SMD: Yes; Sense: No; ComponentHeight: 0.8mm; Author: CERN DEM JLC; HelpURL: \\cern.ch\dfs\Applications\Altium\Datasheets\ADCLK944BCPZ.pdf; CreateDate: 2014-07-17; LatestRevisionDate: 2014-07-17
L13 = IND0603_TDK_MPZ1608R391A: as L9 on sheet PowerSupply; Part Number: IND0603_TDK_MPZ1608R391A; Component Kind: Standard; Component Type: Standard; Pin Count: 2; Value: 390R@100MHz; Status: None; Manufacturer Part Number: MPZ1608R391A; Case: 0603; Mounted: Yes; Socket: No; SMD: Yes; Sense: No; ComponentHeight: 0.95mm; HelpURL: \\cern.ch\dfs\Applications\Altium\Datasheets\IND0603_TDK_MPZ1608.pdf; Author: CERN DEM JLC; CreateDate: 2009-12-02; LatestRevisionDate: 2009-12-02
R92 R94 R95 R97 = R0402_200R_1%_0.0625W_100PPM: Resistor - 1%; Part Description: General Purpose Thick Film Chip Resistor; Manufacturer: GENERIC; Manufacturer1 Part Number: 232270672001L; TC: ±100ppm/°C; Part Number: R0402_200R_1%_0.0625W_100PPM; Component Kind: Standard; Component Type: Standard; Pin Count: 2; Value: 200; Status: Not recommended; Power: 0.0625W; Tolerance: ±1%; Manufacturer Part Number: R0402_200R_1%_0.0625W_100PPM; Case: 0402; Mounted: Yes; Sense: No; Socket: No; SMD: Yes; Manufacturer1 Example: YAGEO PHYCOMP; Manufacturer1 ComponentHeight: 0.4mm; HelpURL: \\cern.ch\dfs\Applications\Altium\Datasheets\R0402_Phycomp_RC0402.pdf; Author: CERN DEM JLC; CreateDate: 2007-12-03; LatestRevisionDate: 2012-10-17

## Sheet IQ_Demodulator.SchDoc: =ProjectName
size 420 x 297 mm; Author: SBH; CompanyName: WUT; DrawnBy: SBH; Organization: ISE-WUT; Address1: Warsaw Univeristy of Technology; Address2: Nowowiejska 15/19; Revision: -; SheetNumber: -; SheetTotal: -; EDA_Number: ARTIQ; Projet: ADC/DAC MEZZANINE; ModifiedBy: -; CreateDate: XX/XX/XXXX; CheckedDate: -; Title2: IQ_Demodulator.SchDoc; DivGrp: ISE; Designer: SBH; ModifiedDate: -; ProjectName: ADC/DAC MEZZANINE
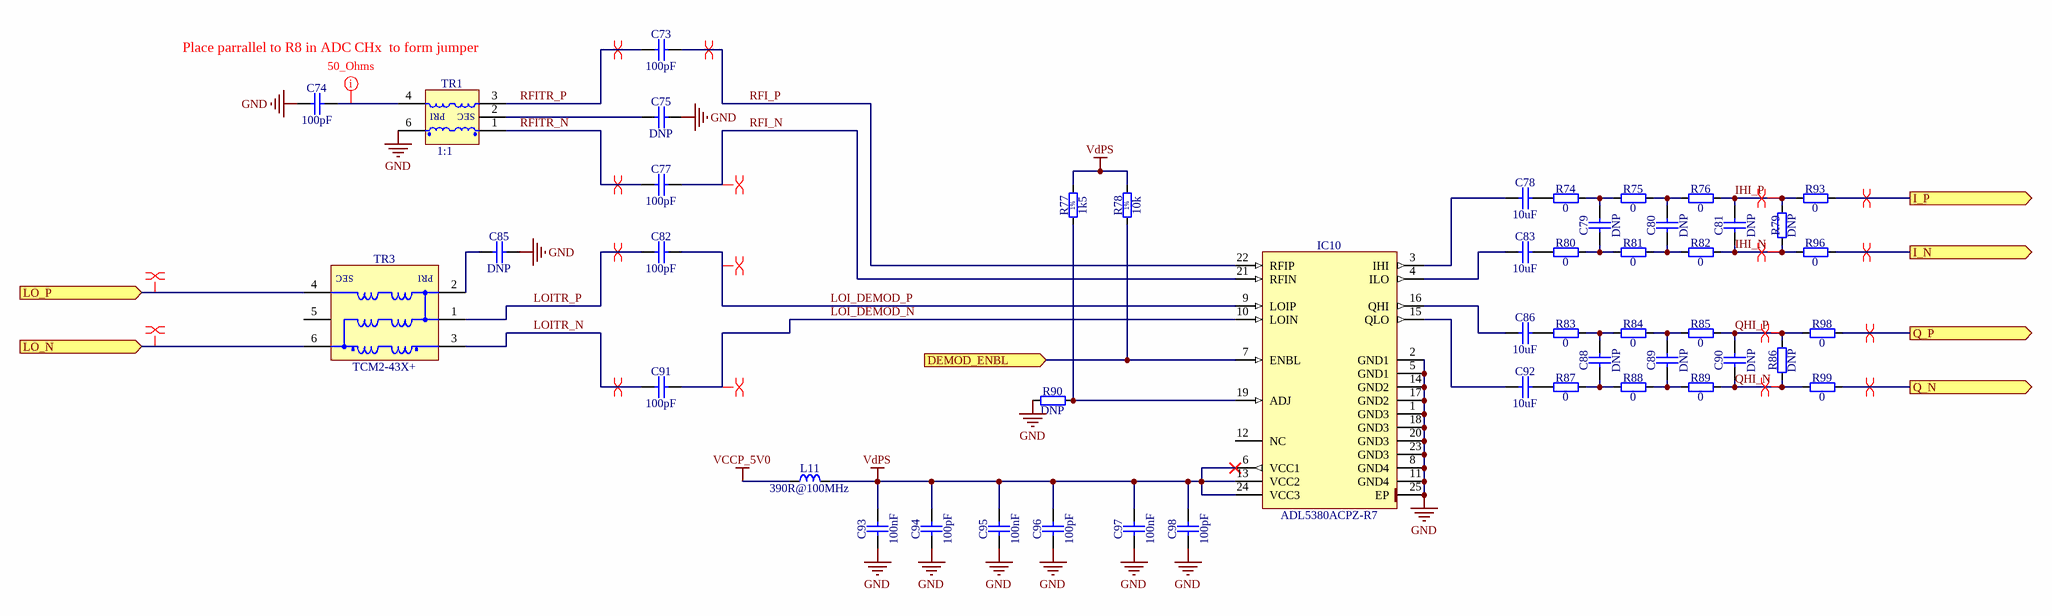
[diagram p7: IQ_Demodulator.SchDoc]

### Parts
C73  100pF  [CAPC1005X55N]
C74  100pF  [CAPC1005X55N]
C75  DNP  [CAPC1005X55N]
C77  100pF  [CAPC1005X55N]
C78  10uF  [CAPC1005X70N]
C79  DNP  [CAPC1005X55N]
C80  DNP  [CAPC1005X55N]
C81  DNP  [CAPC1005X55N]
C82  100pF  [CAPC1005X55N]
C83  10uF  [CAPC1005X70N]
C85  DNP  [CAPC1005X55N]
C86  10uF  [CAPC1005X70N]
C88  DNP  [CAPC1005X55N]
C89  DNP  [CAPC1005X55N]
C90  DNP  [CAPC1005X55N]
C91  100pF  [CAPC1005X55N]
C92  10uF  [CAPC1005X70N]
C93  100nF  [CAPC1005X55N]
C94  100pF  [CAPC1005X55N]
C95  100nF  [CAPC1005X55N]
C96  100pF  [CAPC1005X55N]
C97  100nF  [CAPC1005X55N]
C98  100pF  [CAPC1005X55N]
IC10  ADL5380ACPZ-R7  [QFN50P400X400X100-25N-S265]
L11  390R@100MHz  [INDC1608X95N]
R74  0  [RESC1005X40N]
R75  0  [RESC1005X40N]
R76  0  [RESC1005X40N]
R77  1k5  [RESC1005X40N]
R78  10k  [RESC1005X40N]
R79  DNP  [RESC1005X40N]
R80  0  [RESC1005X40N]
R81  0  [RESC1005X40N]
R82  0  [RESC1005X40N]
R83  0  [RESC1005X40N]
R84  0  [RESC1005X40N]
R85  0  [RESC1005X40N]
R86  DNP  [RESC1005X40N]
R87  0  [RESC1005X40N]
R88  0  [RESC1005X40N]
R89  0  [RESC1005X40N]
R90  DNP  [RESC1005X40N]
R93  0  [RESC1005X40N]
R96  0  [RESC1005X40N]
R98  0  [RESC1005X40N]
R99  0  [RESC1005X40N]
TR1  1:1  [XFMR_MINI-CIRCUITS_AT1521]
TR3  TCM2-43X+  [XFMR_MINI-CIRCUITS_DB1627]

### Ports
DEMOD_ENBL (in), I_N (out), I_P (out), LO_N (in), LO_P (in), Q_N (out), Q_P (out)

### Nets
GND: C74.1 C75.2 C85.2 C93.1 C94.1 C95.1 C96.1 C97.1 C98.1 IC10.1(GND3) IC10.2(GND1) IC10.5(GND1) IC10.8(GND4) IC10.11(GND4) IC10.14(GND2) IC10.17(GND2) IC10.18(GND3) IC10.20(GND3) IC10.23(GND3) IC10.25(EP) R90.1 TR1.6(PDOT)
VCCP_5V0: L11.1
VdPS: C93.2 C94.2 C95.2 C96.2 C97.2 C98.2 IC10.6(VCC1) IC10.13(VCC2) IC10.24(VCC3) L11.2 R77.2 R78.2
IH_N: R96.2 ; port I_N
IH_P: R93.2 ; port I_P
IHI_N: C81.1 R79.1 R82.2 R96.1
IHI_P: C81.2 R76.2 R79.2 R93.1
LO1_N: TR3.6(S1) ; port LO_N
LO1_P: TR3.4(S1) ; port LO_P
LOI_DEMOD_N: C91.2 IC10.10(LOIN)
LOI_DEMOD_P: C82.2 IC10.9(LOIP)
LOITR_N: C91.1 TR3.3(P1)
LOITR_P: C82.1 TR3.1(P1)
MEZZ_IO9: IC10.7(ENBL) R78.1 ; port DEMOD_ENBL
QH_N: R99.2 ; port Q_N
QH_P: R98.2 ; port Q_P
QHI_N: C90.1 R86.1 R89.2 R99.1
QHI_P: C90.2 R85.2 R86.2 R98.1
RFI_N: C77.2 IC10.21(RFIN)
RFI_P: C73.2 IC10.22(RFIP)
RFITR_N: C77.1 TR1.1(SDOT)
RFITR_P: C73.1 TR1.3(S)
NetC74_2: C74.2 TR1.4(P)
NetC75_1: C75.1 TR1.2(NC)
NetC78_1: C78.1 IC10.3(IHI)
NetC78_2: C78.2 R74.1
NetC79_1: C79.1 R80.2 R81.1
NetC79_2: C79.2 R74.2 R75.1
NetC80_1: C80.1 R81.2 R82.1
NetC80_2: C80.2 R75.2 R76.1
NetC83_1: C83.1 IC10.4(ILO)
NetC83_2: C83.2 R80.1
NetC85_1: C85.1 TR3.2(P1)
NetC86_1: C86.1 IC10.16(QHI)
NetC86_2: C86.2 R83.1
NetC88_1: C88.1 R87.2 R88.1
NetC88_2: C88.2 R83.2 R84.1
NetC89_1: C89.1 R88.2 R89.1
NetC89_2: C89.2 R84.2 R85.1
NetC92_1: C92.1 IC10.15(QLO)
NetC92_2: C92.2 R87.1
NetIC10_19: IC10.19(ADJ) R77.1 R90.2

Not connected (* = marked no-connect by the designer): IC10 12(NC); TR3 5(NC)

### Layout directives
differential pair: IH_N, IH_P, IHI_N, IHI_P, LO1_N, LO1_P, LOI_DEMOD_N, LOI_DEMOD_P, LOITR_N, LOITR_P, QH_N, QH_P, QHI_N, QHI_P, RFI_N, RFI_P, RFITR_N, RFITR_P
net class 50_Ohms: NetC74_2

### Notes on the sheet
- Place parrallel to R8 in ADC CHx  to form jumper
- Project/Equipment
- Document
- Designer
- Drawn by
- Check.by
- File
- Last Mod.
- Print Date
- Sheet
- Size
- A3
- of
- Rev
- (in symbol R0402_1K5_1%_0.0625W_100PPM) 1%
- (in symbol R0402_10K_1%_0.0625W_100PPM) 1%
- (in symbol XFMR_MINI-CIRCUITS_TC1-1-43X+) PRI; SEC
- (in symbol XFMR_MINI-CIRCUITS_TCM2-43X+) SEC; PRI

### Library data of the parts
C73 C74 C77 C82 C91 C94 C96 C98 = CC0402_100PF_50V_5%_C0G: as C70 on sheet IQ_Modulator; Part Number: CC0402_100PF_50V_5%_C0G; Component Kind: Standard; Component Type: Standard; Pin Count: 2; Value: 100pF; Status: Preferred; Manufacturer Part Number: CC0402_100PF_50V_5%_C0G; Case: 0402; Mounted: Yes; Socket: No; SMD: Yes; Sense: No; Manufacturer1 Example: KEMET; Manufacturer1 ComponentHeight: 0.55mm; HelpURL: \\cern.ch\dfs\Applications\Altium\Datasheets\CC0805_C0G_KEMET_(Commercial Grade).pdf; Author: CERN DEM JLC; CreateDate: 2007-12-03; LatestRevisionDate: 2015-04-22
C75 C85 = CC0402_100PF_50V_5%_C0G: as C116 on sheet IQ_Modulator; Part Number: CC0402_100PF_50V_5%_C0G; Component Kind: Standard; Component Type: Standard; Pin Count: 2; Status: Preferred; Manufacturer Part Number: CC0402_100PF_50V_5%_C0G; Case: 0402; Socket: No; SMD: Yes; Sense: No; Manufacturer1 Example: KEMET; Manufacturer1 ComponentHeight: 0.55mm; HelpURL: \\cern.ch\dfs\Applications\Altium\Datasheets\CC0805_C0G_KEMET_(Commercial Grade).pdf; Author: CERN DEM JLC; CreateDate: 2007-12-03; LatestRevisionDate: 2015-04-22
C78 C83 C86 C92 = CC0402_10UF_6.3V_20%_X5R: Non-polarised capacitor; Part Description: SMD Multilayer Chip Ceramic Capacitor; Manufacturer: GENERIC; Manufacturer1 Part Number: C1005X5R0J106M050BC; Voltage: 6.3V; TC: X5R; Tolerance: ±10%; Part Number: CC0402_10UF_6.3V_20%_X5R; Component Kind: Standard; Component Type: Standard; Pin Count: 2; Value: 10uF; Status: Preferred; Manufacturer Part Number: CC0402_10UF_6.3V_20%_X5R; Case: 0402; Mounted: Yes; Socket: No; SMD: Yes; Sense: No; Manufacturer1 Example: TDK; Manufacturer1 ComponentHeight: 0.70mm; HelpURL: \\cern.ch\dfs\Applications\Altium\Datasheets\CC0402_X5R_TDK_C.pdf; Author: CERN DEM JLC; CreateDate: 2015-01-07; LatestRevisionDate: 2015-01-07
C79-C81 C88-C90 = CC0402_1.5NF_50V_10%_X7R: as C30 on sheet IQ_Modulator; Part Number: CC0402_1.5NF_50V_10%_X7R; Component Kind: Standard; Component Type: Standard; Pin Count: 2; Status: Not Recommended; Manufacturer Part Number: CC0402_1.5NF_50V_10%_X7R; Case: 0402; Socket: No; SMD: Yes; Sense: No; Manufacturer1 Example: PHYCOMP; Manufacturer1 ComponentHeight: 0.55mm; HelpURL: \\cern.ch\dfs\Applications\Altium\Datasheets\CC0402_X7R_PHYCOMP.pdf; Author: CERN DEM JLC; CreateDate: 2007-12-03; LatestRevisionDate: 2007-12-03
C93 C95 C97 = CC0402_100NF_16V_10%_X7R: as C48 on sheet IQ_Modulator; Part Number: CC0402_100NF_16V_10%_X7R; Component Kind: Standard; Component Type: Standard; Pin Count: 2; Value: 100nF; Status: Not Recommended; Manufacturer Part Number: CC0402_100NF_16V_10%_X7R; Case: 0402; Mounted: Yes; Socket: No; SMD: Yes; Sense: No; Manufacturer1 Example: MURATA; Manufacturer1 ComponentHeight: 0.55mm; HelpURL: \\cern.ch\dfs\Applications\Altium\Datasheets\CC0402_X7R_MURATA_GRM.pdf; Author: CERN DEM JLC; CreateDate: 2013-12-05; LatestRevisionDate: 2007-12-03
IC10 = ADL5380ACPZ-R7: 400 MHz to 6 GHz Quadrature Demodulator; Manufacturer: ANALOG DEVICES; PressFit: No; Bonding: No; Part Number: ADL5380ACPZ-R7; Component Kind: Standard; Component Type: Standard; Device: ADL5380ACPZ-R7; PackageDescription: QFN,0.50mm pitch,square;6 pin X 6 pin,4.0mm X 4.0mm X 1.00mm H body (w/thermal tab 2.65 X 2.65mm),  IPC Medium Density; Part Description: 400 MHz to 6 GHz Quadrature Demodulator; Manufacturer Part Number: ADL5380ACPZ-R7; Pin Count: 25; Case: QFN24; Mounted: Yes; Socket: No; SMD: Yes; Sense: No; ComponentHeight: 1mm; Author: CERN DEM JLC; HelpURL: \\cern.ch\dfs\Applications\Altium\Datasheets\ADL5380ACPZ-R7.pdf; CreateDate: 2011-01-24; LatestRevisionDate: 2011-01-24
L11 = IND0603_TDK_MPZ1608R391A: as L9 on sheet PowerSupply; Part Number: IND0603_TDK_MPZ1608R391A; Component Kind: Standard; Component Type: Standard; Pin Count: 2; Value: 390R@100MHz; Status: None; Manufacturer Part Number: MPZ1608R391A; Case: 0603; Mounted: Yes; Socket: No; SMD: Yes; Sense: No; ComponentHeight: 0.95mm; HelpURL: \\cern.ch\dfs\Applications\Altium\Datasheets\IND0603_TDK_MPZ1608.pdf; Author: CERN DEM JLC; CreateDate: 2009-12-02; LatestRevisionDate: 2009-12-02
R74-R76 R80-R85 R87-R89 R93 R96 R98 R99 = R0402_0R_JUMPER: as R6 on sheet ADC_channel; Part Number: R0402_0R_JUMPER; Component Kind: Standard; Component Type: Standard; Pin Count: 2; Value: 0; Status: Not recommended; Manufacturer Part Number: R0402_0R_JUMPER; Case: 0402; Mounted: Yes; Sense: No; Socket: No; SMD: Yes; Manufacturer1 Example: YAGEO PHYCOMP; Manufacturer1 ComponentHeight: 0.4mm; HelpURL: \\cern.ch\dfs\Applications\Altium\Datasheets\R0402_Phycomp_RC0402.pdf; Author: CERN DEM JLC; CreateDate: 2007-12-03; LatestRevisionDate: 2012-10-17
R77 = R0402_1K5_1%_0.0625W_100PPM: Resistor - 1%; Part Description: General Purpose Thick Film Chip Resistor; Manufacturer: GENERIC; Manufacturer1 Part Number: 232270671502L; TC: ±100ppm/°C; Part Number: R0402_1K5_1%_0.0625W_100PPM; Component Kind: Standard; Component Type: Standard; Pin Count: 2; Value: 1k5; Status: Not recommended; Power: 0.0625W; Tolerance: ±1%; Manufacturer Part Number: R0402_1K5_1%_0.0625W_100PPM; Case: 0402; Mounted: Yes; Sense: No; Socket: No; SMD: Yes; Manufacturer1 Example: YAGEO PHYCOMP; Manufacturer1 ComponentHeight: 0.4mm; HelpURL: \\cern.ch\dfs\Applications\Altium\Datasheets\R0402_Phycomp_RC0402.pdf; Author: CERN DEM JLC; CreateDate: 2007-12-03; LatestRevisionDate: 2012-10-17
R78 = R0402_10K_1%_0.0625W_100PPM: as R38 on sheet IQ_Modulator; Part Number: R0402_10K_1%_0.0625W_100PPM; Component Kind: Standard; Component Type: Standard; Pin Count: 2; Value: 10k; Status: Not recommended; Power: 0.0625W; Tolerance: ±1%; Manufacturer Part Number: R0402_10K_1%_0.0625W_100PPM; Case: 0402; Mounted: Yes; Sense: No; Socket: No; SMD: Yes; Manufacturer1 Example: YAGEO PHYCOMP; Manufacturer1 ComponentHeight: 0.4mm; HelpURL: \\cern.ch\dfs\Applications\Altium\Datasheets\R0402_Phycomp_RC0402.pdf; Author: CERN DEM JLC; CreateDate: 2007-12-03; LatestRevisionDate: 2012-10-17
R79 R86 R90 = R0402_0R_JUMPER: Resistor; Part Description: 1A (0.05R Max DC Resistance) Zero Ohm Jumper; Manufacturer: GENERIC; Manufacturer1 Part Number: 232270591001L; Value: 0; Mounted: DNP; Part Number: R0402_0R_JUMPER; Component Kind: Standard; Component Type: Standard; Pin Count: 2; Status: Not recommended; Manufacturer Part Number: R0402_0R_JUMPER; Case: 0402; Sense: No; Socket: No; SMD: Yes; Manufacturer1 Example: YAGEO PHYCOMP; Manufacturer1 ComponentHeight: 0.4mm; HelpURL: \\cern.ch\dfs\Applications\Altium\Datasheets\R0402_Phycomp_RC0402.pdf; Author: CERN DEM JLC; CreateDate: 2007-12-03; LatestRevisionDate: 2012-10-17
TR1 = XFMR_MINI-CIRCUITS_TC1-1-43X+: 50 Ohms 650 To 4000MHz RF Transformer; Part Number: XFMR_MINI-CIRCUITS_TC1-1-43X+; Component Kind: Standard; Component Type: Standard; Pin Count: 5; Value: 1:1; Status: None; Part Description: 50 Ohms 650 To 4000MHz RF Transformer; Manufacturer: MINI-CIRCUITS; Manufacturer Part Number: TC1-1-43X+; Mounted: Yes; Socket: No; Sense: No; SMD: Yes; ComponentHeight: 4.06mm; HelpURL: \\cern.ch\dfs\Applications\Altium\Datasheets\XFMR_MINI-CIRCUITS_TC1-1-43X+.pdf; Author: CERN DEM JMW; CreateDate: 2016-08-10; LatestRevisionDate: 2016-08-10
TR3 = XFMR_MINI-CIRCUITS_TCM2-43X+: as TR2 on sheet IQ_Modulator; Part Number: XFMR_MINI-CIRCUITS_TCM2-43X+; Component Kind: Standard; Component Type: Standard; Pin Count: 6; Value: TCM2-43X+; Status: None; Part Description: 50 Ohms 10 to 4000MHz RF Transformer; Manufacturer: MINI-CIRCUITS; Manufacturer Part Number: TCM2-43X+; Mounted: Yes; Socket: No; Sense: No; SMD: Yes; ComponentHeight: 4.06mm; HelpURL: \\cern.ch\dfs\Applications\Altium\Datasheets\XFMR_MINI-CIRCUITS_TCM2-43X+.pdf; Author: CERN DEM BC; CreateDate: 2016-02-12; LatestRevisionDate: 2016-02-12

## Nets that join several sheets
ADC_VCM: U_ADC_channel1 (L2A.1), U_ADC_channel2 (L2B.1), B2B_connectors  (J13.33)
GND: U_ADC_channel1 (24 pins), U_ADC_channel2 (24 pins), DAC_channel (73 pins), B2B_connectors  (18 pins), PowerSupply (24 pins), IQ_Modulator (20 pins), LO_Distribution (12 pins), IQ_Demodulator (22 pins)
VCCN_5V0_A: U_ADC_channel1 (L5A.1), U_ADC_channel2 (L5B.1), PowerSupply (C53.2 IC9.5)
VCCN_6V0_A: B2B_connectors  (J13.31), PowerSupply (L10.1)
VCCN_12V0_A: U_ADC_channel1 (6 pins), U_ADC_channel2 (6 pins), B2B_connectors  (J13.25)
VCCP_5V0: U_ADC_channel1 (L3A.2), U_ADC_channel2 (L3B.2), DAC_channel (L6.2 L7.1 L8.2), PowerSupply (C11.2 IC8.9 IC8.10 L12.1), IQ_Modulator (L4.1), IQ_Demodulator (L11.1)
VCCP_6V0_A: B2B_connectors  (J13.32 J13.34), PowerSupply (L9.1)
VCCP_11V5_A: DAC_channel (C12.2 C13.2 R5.1), PowerSupply (C76.2 IC15.9 IC15.10)
VCCP_12V0_A: U_ADC_channel1 (5 pins), U_ADC_channel2 (5 pins), B2B_connectors  (J13.26), PowerSupply (L14.1)
VCCP_LO_3V3: PowerSupply (C99.2 IC12.9 IC12.10), LO_Distribution (L13.1)
ADC1_IN_N: U_ADC_channel1 (C63A.1 R42A.1), B2B_connectors  (J3.1)
ADC1_IN_P: U_ADC_channel1 (C63A.2 R40A.1), B2B_connectors  (J1.1)
ADC2_IN_N: U_ADC_channel2 (C63B.1 R42B.1), B2B_connectors  (J6.1)
ADC2_IN_P: U_ADC_channel2 (C63B.2 R40B.1), B2B_connectors  (J4.1)
ADC_CH3: DAC_channel (U1.8), B2B_connectors  (J13.40)
ATT2_CTRL.CLK: DAC_channel (IC3.21), B2B_connectors  (J13.6)
ATT2_CTRL.LE: DAC_channel (IC3.22), B2B_connectors  (J13.3)
ATT2_CTRL.RST: DAC_channel (IC3.20), B2B_connectors  (J13.4)
ATT2_CTRL.S_IN: DAC_channel (IC3.24), B2B_connectors  (J13.9)
DAC1_OUT_N: B2B_connectors  (J9.1), IQ_Modulator (C30.1 R67.1 R68.1)
DAC1_OUT_P: B2B_connectors  (J7.1), IQ_Modulator (C30.2 R60.1 R65.2)
DAC2_OUT_N: B2B_connectors  (J12.1), IQ_Modulator (C45.2 R69.1 R70.2)
DAC2_OUT_P: B2B_connectors  (J10.1), IQ_Modulator (C45.1 R72.1 R73.1)
DAC2_PD: DAC_channel (R26.2 R27.2), B2B_connectors  (J13.38)
Disable_Output: B2B_connectors  (J13.10), IQ_Modulator (IC11.1 R38.1)
IH_N: U_ADC_channel2 (R13B.1 R24B.2), IQ_Demodulator (R96.2)
IH_P: U_ADC_channel2 (R8B.1 R9B.1 R16B.2), IQ_Demodulator (R93.2)
LO0_N: IQ_Modulator (TR2.6), LO_Distribution (C105.2)
LO0_P: IQ_Modulator (TR2.4), LO_Distribution (C102.2)
LO1_N: LO_Distribution (C108.2), IQ_Demodulator (TR3.6)
LO1_P: LO_Distribution (C107.2), IQ_Demodulator (TR3.4)
LOM_N: B2B_connectors  (J15.1 R17.1), LO_Distribution (C106.1)
LOM_P: B2B_connectors  (J14.1 R17.2), LO_Distribution (C104.1)
MEZZ_IO4: U_ADC_channel1 (IC6A.5), B2B_connectors  (J13.7)
MEZZ_IO5: U_ADC_channel1 (IC6A.4), B2B_connectors  (J13.8)
MEZZ_IO8: U_ADC_channel2 (IC6B.5), B2B_connectors  (J13.11)
MEZZ_IO9: B2B_connectors  (J13.12), IQ_Demodulator (IC10.7 R78.1)
MEZZ_IO10: U_ADC_channel2 (IC6B.4), B2B_connectors  (J13.13)
QH_N: U_ADC_channel1 (R13A.1 R24A.2), IQ_Demodulator (R99.2)
QH_P: U_ADC_channel1 (R8A.1 R9A.1 R16A.2), IQ_Demodulator (R98.2)
RF_IN: DAC_channel (R59.1), IQ_Modulator (C44.2)
RFSW2_CTRL: DAC_channel (IC7.2 R20.2), B2B_connectors  (J13.5)